# EasyEDA Pro project Amplifier Module C.eprj

# Schematic Schematic1
Create Date: 2024-02-14; Page Name: P1; Project Name: Amplifier Module C; Schematic Name: Schematic1; Update Date: 2024-05-04; Company: EasyEDA.com; Drawn: EasyEDA; Page Size: A4; Part Number: JLCPCB-002; Reviewed: EasyEDA; Version: V0.1
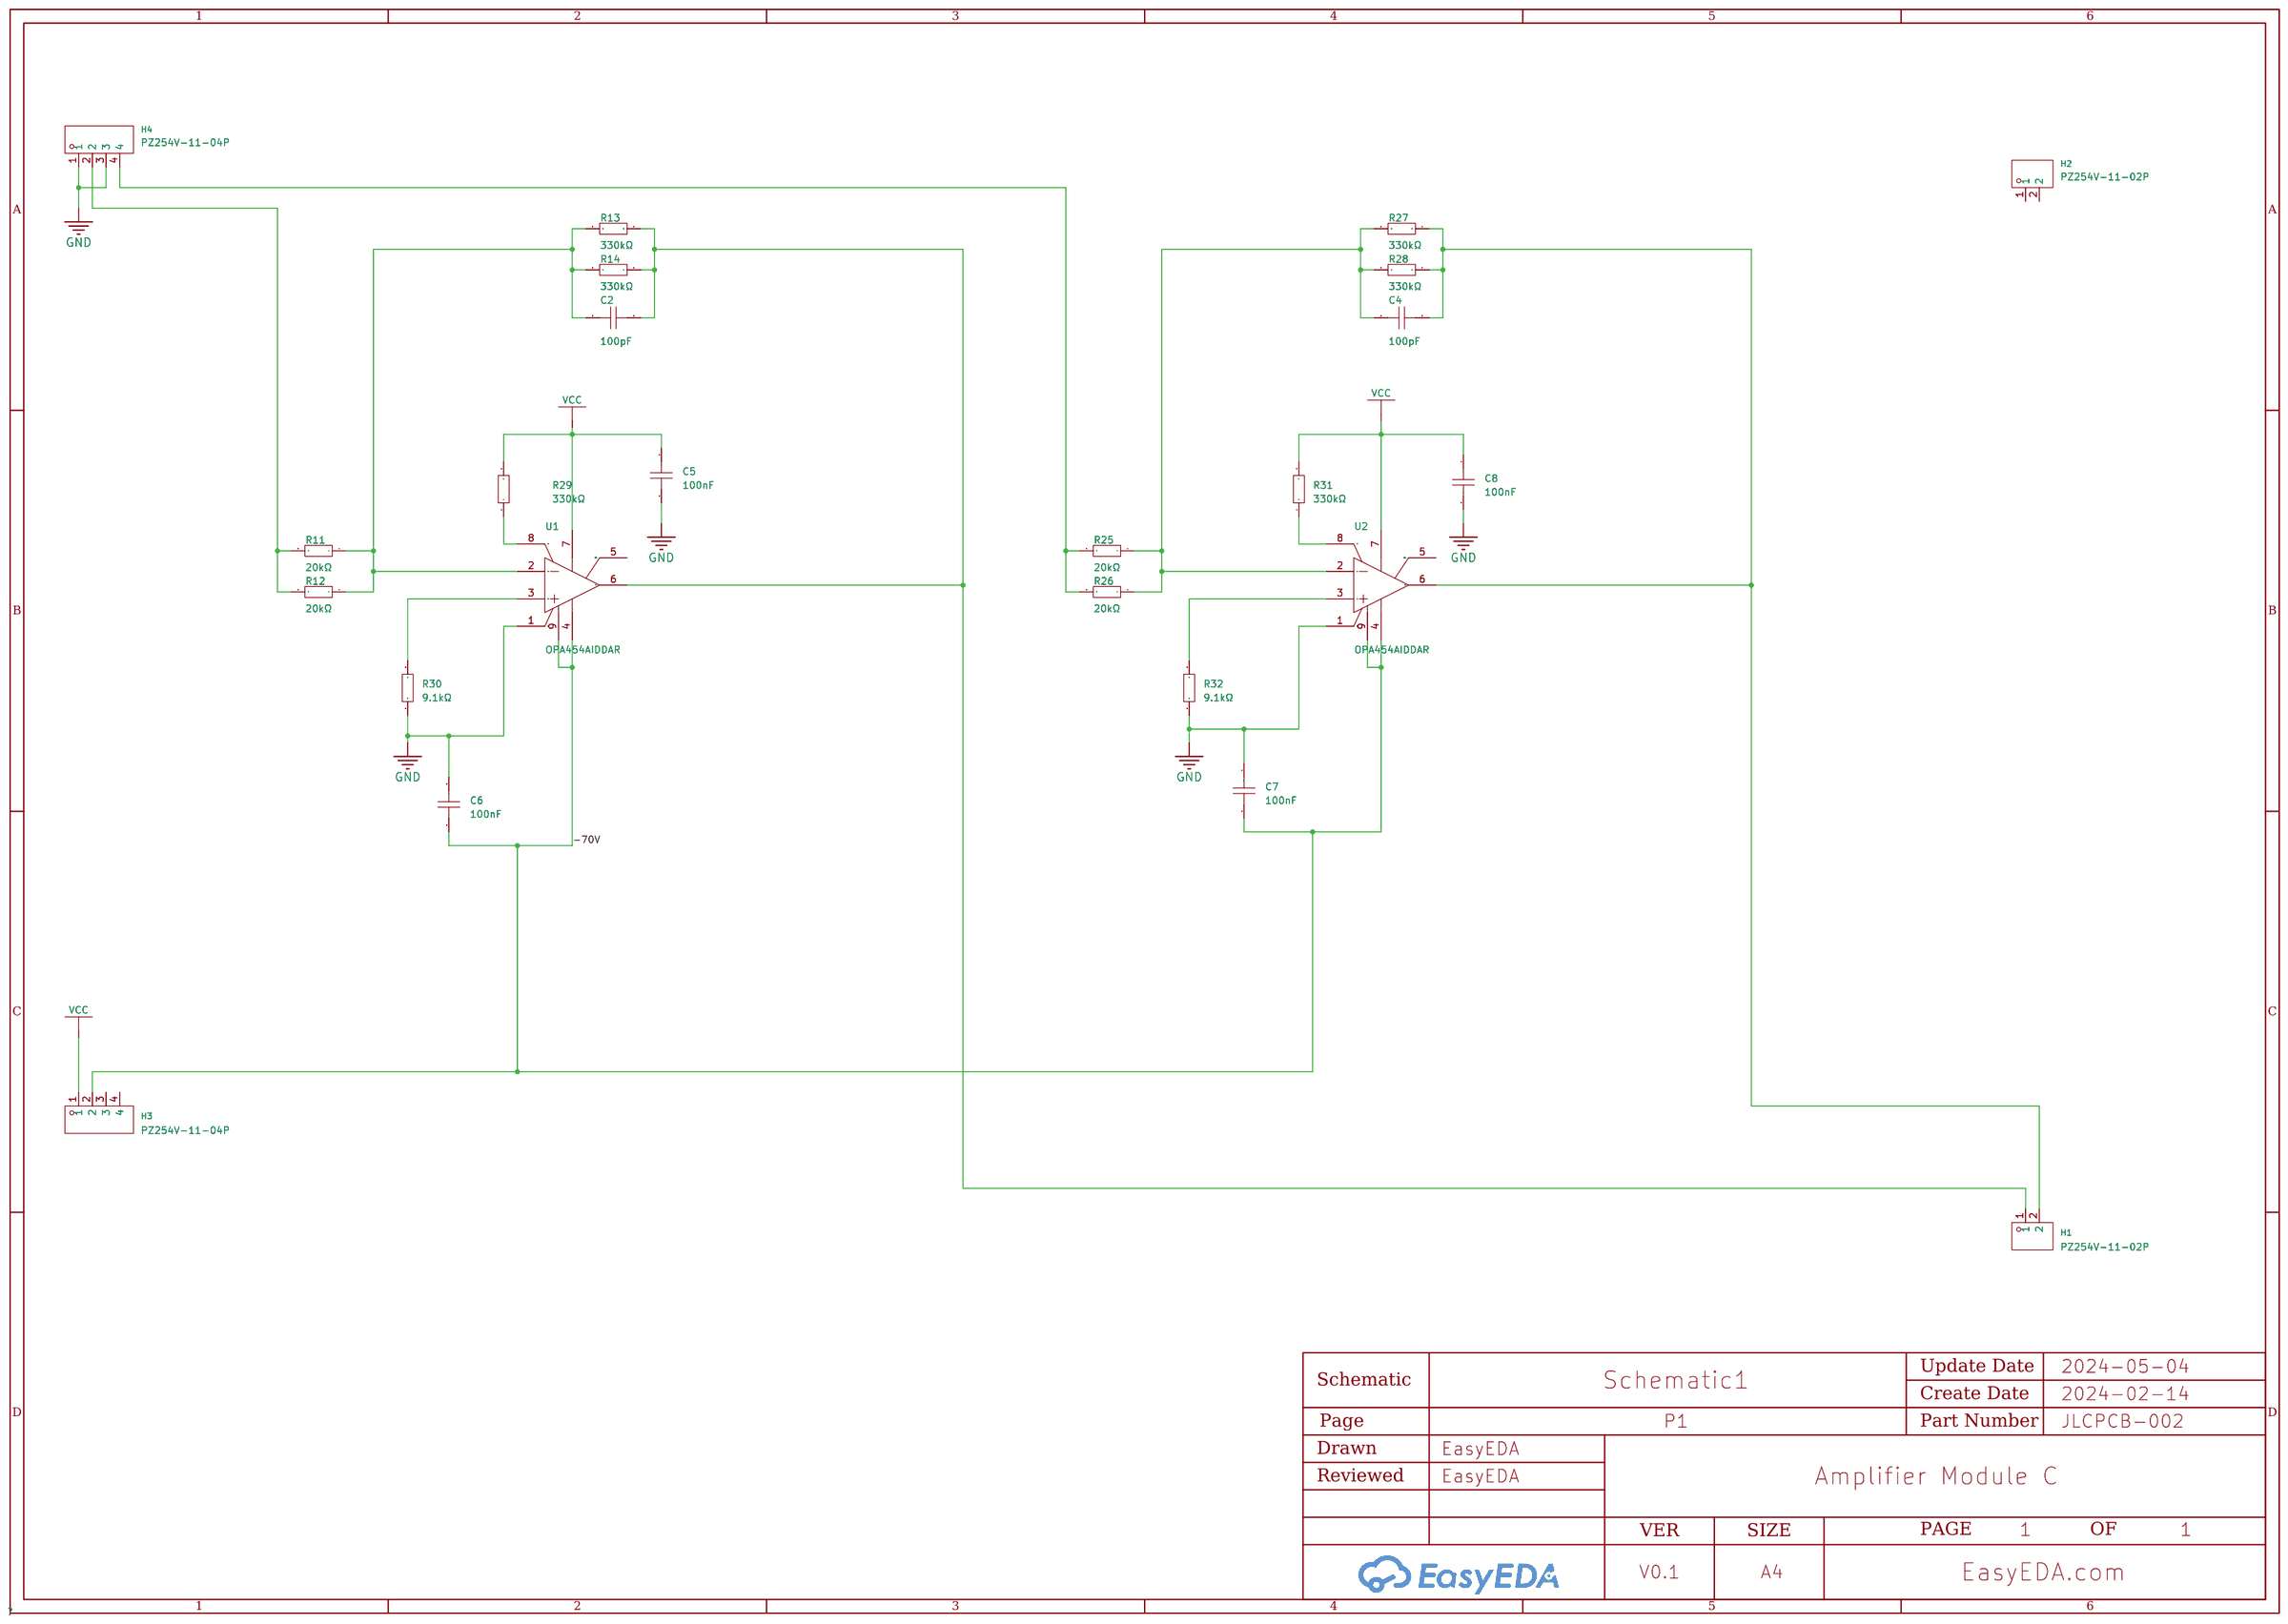
[diagram p0: schematic sheet]

## Parts
C2  100pF  [C0603]
C4  100pF  [C0603]
C5  100nF  [C0603]
C6  100nF  [C0603]
C7  100nF  [C0603]
C8  100nF  [C0603]
H1  PZ254V-11-02P  [HDR-TH_2P-P2.54-V-M]  (no BOM)
H2  PZ254V-11-02P  [HDR-TH_2P-P2.54-V-M]  (no BOM)
H3  PZ254V-11-04P  [HDR-TH_4P-P2.54-V-M]  (no BOM)
H4  PZ254V-11-04P  [HDR-TH_4P-P2.54-V-M]  (no BOM)
R11  20kΩ  [R0603]
R12  20kΩ  [R0603]
R13  330kΩ  [R0603]
R14  330kΩ  [R0603]
R25  20kΩ  [R0603]
R26  20kΩ  [R0603]
R27  330kΩ  [R0603]
R28  330kΩ  [R0603]
R29  330kΩ  [R0603]
R30  9.1kΩ  [R0603]
R31  330kΩ  [R0603]
R32  9.1kΩ  [R0603]
U1  OPA454AIDDAR  [SOIC-8_L4.9-W3.9-P1.27-LS6.0-BL-EP]
U2  OPA454AIDDAR  [SOIC-8_L4.9-W3.9-P1.27-LS6.0-BL-EP]

## Library data of the parts
C2 C4 = 0603CG101J101NT: Capacitance: Tolerance:±5% Tolerance:±5% Voltage Rated: Temperature Coefficient:; LCSC Part Name: 100pF ±5% 100V; Supplier Part: C44567; Manufacturer: FH(风华); Supplier Footprint: 0603; JLCPCB Part Class: Extended Part; Datasheet: https://atta.szlcsc.com/upload/public/pdf/source/20200305/C486355_26A10D38EF8C2A5C37091D0039909270.pdf; Supplier: LCSC; Tolerance: ±5%
C5-C8 = 0603B104K101NT: Capacitance:100nF Tolerance:±10% Tolerance:±10% Voltage Rated: Temperature Coefficient:; LCSC Part Name: 100nF ±10% 100V; Supplier Part: C88219; Manufacturer: FH(风华); Supplier Footprint: 0603; JLCPCB Part Class: Extended Part; Datasheet: https://atta.szlcsc.com/upload/public/pdf/source/20200305/C486355_26A10D38EF8C2A5C37091D0039909270.pdf; Supplier: LCSC; Tolerance: ±10%
H1 H2 = PZ254V-11-02P: Pin Structure:1x2P Pitch:2.54mm Row Spacing:- Circluar Pins/Square Pins:Square Pins Mounting Type:Straight Number of Rows:Plugin Number of Pins:2P Current Rating (Max):- Voltage Rating (Max):- Length of Mating Pin:6mm Insulation Height:2.5mm Length of End; LCSC Part Name: 间距:2.54mm 1x2P 直插 方针; Supplier Part: C492401; Manufacturer: XFCN(兴飞); Supplier Footprint: 插件,P=2.54mm; JLCPCB Part Class: Extended Part; Datasheet: https://atta.szlcsc.com/upload/public/pdf/source/20200309/C492401_A812433581A9B211A7FFA413ADDFF0E5.pdf; Supplier: LCSC; Pin Structure: 1x2P; Pitch: 2.54mm; Circluar Pins/Square Pins: Square Pins; Mounting Type: Straight; Number of Rows: Plugin; Number of Pins: 2P; Length of Mating Pin: 6mm; Insulation Height: 2.5mm; Length of End Connection Pin: 3mm; Operating Temperature Range: -40℃~+105℃; Color: Black
H3 H4 = PZ254V-11-04P: Pin Structure:1x4P Pitch:2.54mm Row Spacing:- Circluar Pins/Square Pins:Square Pins Mounting Type:Straight Number of Rows:Plugin Number of Pins:4P Current Rating (Max):3A Voltage Rating (Max):250V Length of Mating Pin:6mm Insulation Height:2.5mm Length of; LCSC Part Name: 间距:2.54mm 1x4P 直插 方针; Supplier Part: C2691448; Manufacturer: XFCN(兴飞); Supplier Footprint: 插件,P=2.54mm; JLCPCB Part Class: Extended Part; Datasheet: https://atta.szlcsc.com/upload/public/pdf/source/20200309/C492403_F9F19131791D08044AD4F84F8E751A34.pdf; Supplier: LCSC; Pin Structure: 1x4P; Pitch: 2.54mm; Circluar Pins/Square Pins: Square Pins; Mounting Type: Straight; Number of Rows: Plugin; Number of Pins: 4P; Current Rating (Max): 3A; Voltage Rating (Max): 250V; Length of Mating Pin: 6mm; Insulation Height: 2.5mm; Length of End Connection Pin: 3mm; Operating Temperature Range: -40℃~+105℃; Color: Black
R11 R12 R25 R26 = 0603WAF2002T5E: Type:Thick Film Resistors Resistance:20kΩ Tolerance:±1% Tolerance:±1% Power(Watts): Overload Voltage (Max): Temperature Coefficient:±100ppm/℃ Temperature Coefficient:±100ppm/℃ Operating Temperature Range:-55℃~+155℃ Operating Temperature Range:-55℃~+155℃; LCSC Part Name: 20kΩ ±1% 100mW 厚膜电阻; Supplier Part: C4184; Manufacturer: UNI-ROYAL(厚声); Supplier Footprint: 0603; JLCPCB Part Class: Basic Part; Datasheet: https://atta.szlcsc.com/upload/public/pdf/source/20200306/C422600_1E6D84923E4A46A82E41ADD87F860B5C.pdf; Supplier: LCSC; Type: Thick Film Resistors; Tolerance: ±1%; Temperature Coefficient: ±100ppm/℃; Operating Temperature Range: -55℃~+155℃
R13 R14 R27-R29 R31 = 0603WAF3303T5E: Type:Thick Film Resistors Resistance:330kΩ Tolerance:±1% Tolerance:±1% Power(Watts): Overload Voltage (Max): Temperature Coefficient:±100ppm/℃ Temperature Coefficient:±100ppm/℃ Operating Temperature Range:-55℃~+155℃ Operating Temperature Range:-55℃~+155℃; LCSC Part Name: 330kΩ ±1% 100mW 厚膜电阻; Supplier Part: C23137; Manufacturer: UNI-ROYAL(厚声); Supplier Footprint: 0603; JLCPCB Part Class: Basic Part; Datasheet: https://atta.szlcsc.com/upload/public/pdf/source/20200306/C422600_1E6D84923E4A46A82E41ADD87F860B5C.pdf; Supplier: LCSC; Type: Thick Film Resistors; Tolerance: ±1%; Temperature Coefficient: ±100ppm/℃; Operating Temperature Range: -55℃~+155℃
R30 R32 = 0603WAF9101T5E: Type:Thick Film Resistors Resistance:9.1kΩ Tolerance:±1% Tolerance:±1% Power(Watts): Overload Voltage (Max): Temperature Coefficient:±100ppm/℃ Temperature Coefficient:±100ppm/℃ Operating Temperature Range:-55℃~+155℃ Operating Temperature Range:-55℃~+155℃; LCSC Part Name: 9.1kΩ ±1% 100mW 厚膜电阻; Supplier Part: C23260; Manufacturer: UNI-ROYAL(厚声); Supplier Footprint: 0603; JLCPCB Part Class: Basic Part; Datasheet: https://atta.szlcsc.com/upload/public/pdf/source/20200306/C422600_1E6D84923E4A46A82E41ADD87F860B5C.pdf; Supplier: LCSC; Type: Thick Film Resistors; Tolerance: ±1%; Temperature Coefficient: ±100ppm/℃; Operating Temperature Range: -55℃~+155℃
U1 U2 = OPA454AIDDAR: Number of Circuits:单路 Gain Bandwidth Product(GBP):2.5MHz Current - Input Bias(Ib):1.4pA Slew Rate(SR):13V/us Output Current:- -3db Bandwidth:- Supply Current:3.2mA Operating Temperature:-40℃~+85℃ Operating Temperature:-40℃~+85℃; Supplier Part: C50636; Manufacturer: TI(德州仪器); Supplier Footprint: SOIC-8-EP; JLCPCB Part Class: Extended Part; Datasheet: https://www.ti.com/cn/lit/gpn/opa454; Supplier: LCSC; Number of Circuits: 单路; Gain Bandwidth Product(GBP): 2.5MHz; Current - Input Bias(Ib): 1.4pA; Slew Rate(SR): 13V/us; Supply Current: 3.2mA; Operating Temperature: -40℃~+85℃

## Nets
-70V: C6.2 C7.2 H3.2 U1.4(V-) U1.9(EP) U2.4(V-) U2.9(EP)
GND: C5.2 C6.1 C7.1 C8.2 H4.1 H4.3 R30.1 R32.1 U1.1(ED COM) U2.1(ED COM)
VCC: C5.1 C8.1 H3.1 R29.2 R31.2 U1.7(V+) U2.7(V+)
$1N1603: C2.2 R11.1 R12.1 R13.2 R14.2 U1.2(IN-)
$1N4259: H4.2 R11.2 R12.2
$1N6277: C4.2 R25.1 R26.1 R27.2 R28.2 U2.2(IN-)
$1N6394: H4.4 R25.2 R26.2
$1N18596: R29.1 U1.8(ED)
$1N18673: R30.2 U1.3(IN+)
$1N18724: C2.1 H1.1 R13.1 R14.1 U1.6(OUT)
$1N18881: R31.1 U2.8(ED)
$1N18885: R32.2 U2.3(IN+)
$1N18975: C4.1 H1.2 R27.1 R28.1 U2.6(OUT)

Not connected (* = marked no-connect by the designer): H2 1 2; H3 3 4; U1 5(STATUS FLAG); U2 5(STATUS FLAG)

# Board PCB1
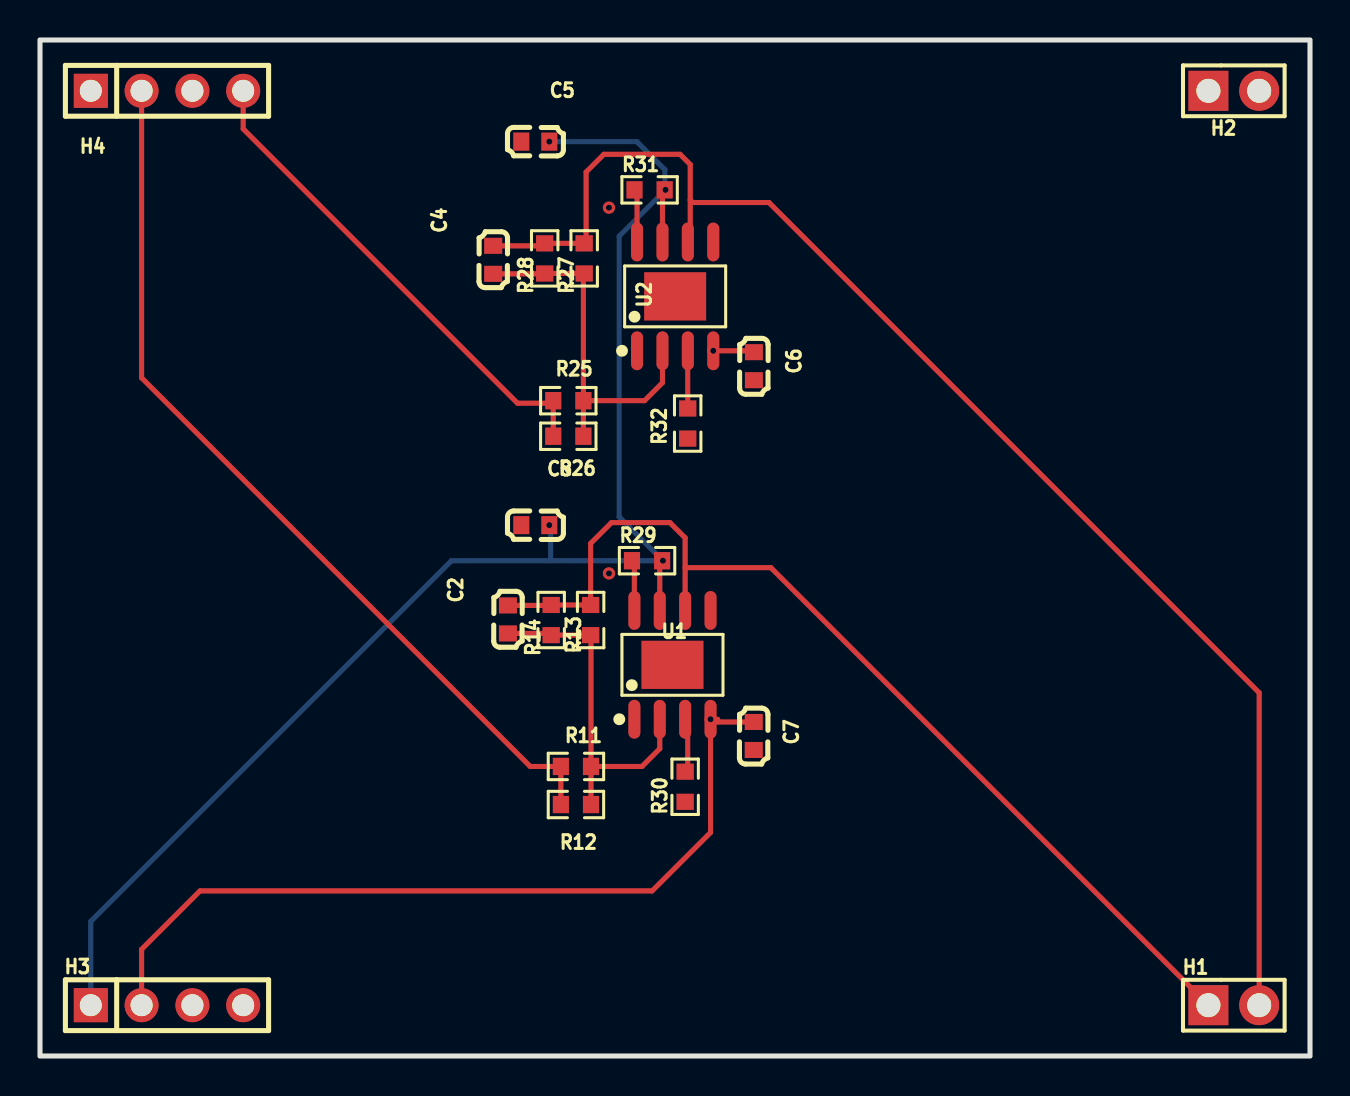
[diagram p1: board, top side]
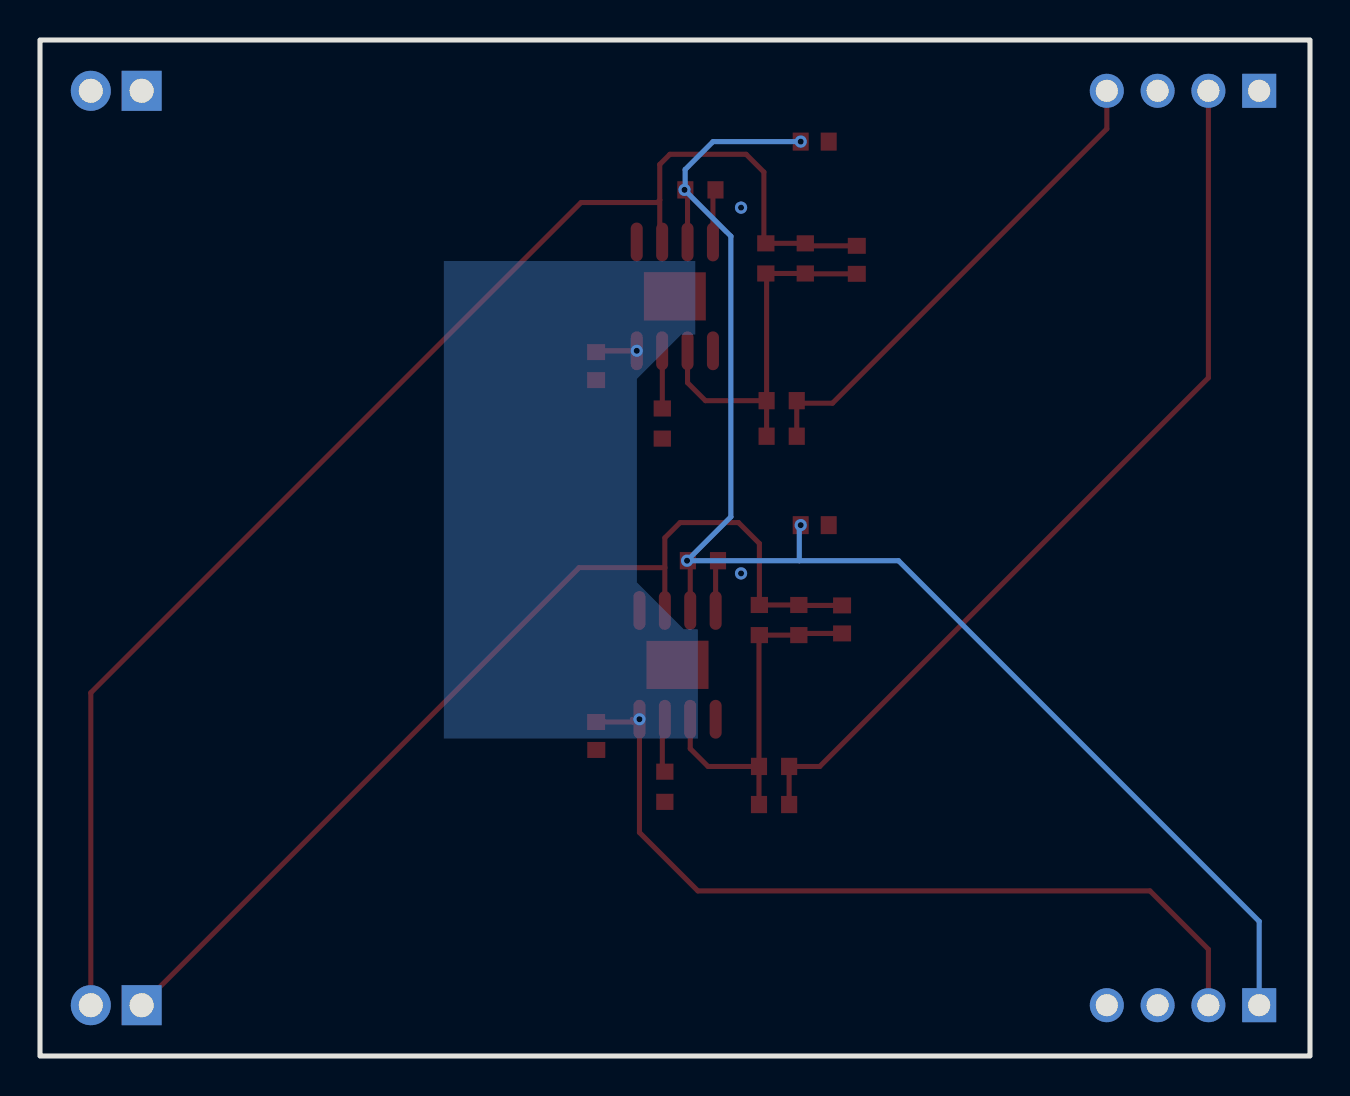
[diagram p2: board, bottom side, seen from below]

Outline 63.5 x 50.8 mm; copper layers: Top Layer, Bottom Layer. Coordinates in mm from the lower left corner of the outline.
Outline path: rectangle 0,50.8 63.5,0
Stack: Top Layer 0.035mm / Dielectric1 1.51mm FR4 er 4.5 / Bottom Layer 0.035mm

## Design rules (mm)
template: JLCPCB Capability(Two Layers Board)
spacing copperThickness1oz (default): track to track 0.102, other pairs 0.152 to 0.3
spacing copperThickness2oz: track to track 0.203, other pairs 0.152 to 0.3
track width copperThickness1oz (default): min 0.127, default 0.254, max 2.54
track width copperThickness2oz: min 0.203, default 0.254, max 2.54
differential pair differentialPair (default): width min 0.127, default 0.254, max 2.54; gap min 0.152, default 0.152
via viaSize (default): diameter min 0.5, default 0.61, max 10; hole min 0.3, default 0.305, max 6.3

## Placement (name value [footprint] x y rotation side)
C2  100pF  [C0603]  23.4 21.83 270 top
C4  100pF  [C0603]  22.66 39.81 270 top
C5  100nF  [C0603]  24.76 45.72 180 top
C6  100nF  [C0603]  35.7 34.49 90 top
C7  100nF  [C0603]  35.69 16 90 top
C8  100nF  [C0603]  24.76 26.54 180 top
H1  PZ254V-11-02P  [HDR-TH_2P-P2.54-V-M]  59.69 2.54 0 top
H2  PZ254V-11-02P  [HDR-TH_2P-P2.54-V-M]  59.69 48.26 0 top
H3  PZ254V-11-04P  [HDR-TH_4P-P2.54-V-M]  6.35 2.54 0 top
H4  PZ254V-11-04P  [HDR-TH_4P-P2.54-V-M]  6.35 48.26 0 top
R11  20kΩ  [R0603]  26.8 14.48 180 top
R12  20kΩ  [R0603]  26.8 12.57 180 top
R13  330kΩ  [R0603]  27.53 21.8 270 top
R14  330kΩ  [R0603]  25.56 21.8 270 top
R25  20kΩ  [R0603]  26.42 32.77 180 top
R26  20kΩ  [R0603]  26.42 30.99 180 top
R27  330kΩ  [R0603]  27.21 39.88 270 top
R28  330kΩ  [R0603]  25.24 39.88 270 top
R29  330kΩ  [R0603]  30.35 24.77 0 top
R30  9.1kΩ  [R0603]  32.26 13.46 90 top
R31  330kΩ  [R0603]  30.48 43.31 0 top
R32  9.1kΩ  [R0603]  32.38 31.62 90 top
U1  OPA454AIDDAR  [SOIC-8_L4.9-W3.9-P1.27-LS6.0-BL-EP]  31.62 19.56 0 top
U2  OPA454AIDDAR  [SOIC-8_L4.9-W3.9-P1.27-LS6.0-BL-EP]  31.76 37.98 0 top

## Footprints (pads in the part's own frame, mm; a bottom-side part is the same pattern mirrored in y, then rotated)
C0603
  rect 0.8x0.9 smd: 1(-0.7,0) 2(0.7,0)
HDR-TH_2P-P2.54-V-M
  rect 2x2 hole 1.2: 1(-1.27,0)
  round 2 hole 1.2: 2(1.27,0)
HDR-TH_4P-P2.54-V-M
  rect 1.7x1.7 hole 1.1: 1(-3.81,0)
  round 1.7 hole 1.1: 2(-1.27,0) 3(1.27,0) 4(3.81,0)
R0603
  rect 0.806x0.864 smd: 1(-0.753,0) 2(0.753,0)
SOIC-8_L4.9-W3.9-P1.27-LS6.0-BL-EP
  oval 0.602x1.941 smd: 1(-1.905,-2.72) 2(-0.635,-2.72) 3(0.635,-2.72) 4(1.905,-2.72) 5(1.905,2.72) 6(0.635,2.72) 7(-0.635,2.72) 8(-1.905,2.72)
  rect 3.098x2.41 smd: 9(0,0)

## Nets
As in the schematic.

Pads without a net: H2 1 2; H3 3 4; U1 5; U2 5

## Via types
v1: diameter 0.61, hole 0.305, Top Layer to Bottom Layer, 8 vias

## Routing (per net, layer and track width the routed paths; a pad name or vN(x,y) marks a point on that pad's centre or on a via; arc(x,y) is an arc through that point)
-70V: length 43.3
  Top Layer w0.254: v1(33.53,16.84) 33.53,11.18 30.61,8.25 8,8.25 5.08,5.33 H3.2 ; 33.88,16.84 33.88,16.7 C7.2 ; v1(33.66,35.26) 35.63,35.26 C6.2
GND:
  vias: v1(28.45,42.42) v1(28.45,24.13)
VCC: length 75.1
  Top Layer w0.254: U1.7 30.99,24.65 R29.2 ; U2.7 31.12,43.2 R31.2
  Bottom Layer w0.254: v1(25.47,26.54) 25.53,26.47 25.53,24.77 ; 25.53,24.77 20.57,24.77 2.54,6.73 H3.1 ; 25.53,24.77 v1(31.15,24.77) 28.96,26.96 28.96,40.99 v1(31.28,43.31) 31.24,43.34 31.24,44.32 29.84,45.72 v1(25.47,45.72)
$1N1603: length 17.9
  Top Layer w0.254: R11.1 R12.1 ; R11.1 30.1,14.48 30.99,15.37 U1.2 ; R11.1 27.55,21.03 R13.2 R14.2 25.47,21.13 C2.2
$1N4259: length 45.3
  Top Layer w0.254: H4.2 5.08,33.91 24.51,14.48 R11.2 R12.2
$1N6277: length 18.6
  Top Layer w0.254: R25.1 30.23,32.77 31.12,33.66 U2.2 ; R25.1 R26.1 ; R25.1 27.17,39.09 R27.2 R28.2 25.22,39.11 C4.2
$1N6394: length 24.9
  Top Layer w0.254: H4.4 10.16,46.36 23.88,32.64 25.54,32.64 R25.2 R26.2
$1N18596: length 2.5
  Top Layer w0.254: R29.1 29.72,24.65 U1.8
$1N18673: length 2.7
  Top Layer w0.254: U1.3 32.38,16.71 32.38,14.34 R30.2
$1N18724: length 51.5
  Top Layer w0.254: C2.1 25.54,22.53 R14.1 R13.1 27.53,25.63 28.57,26.67 31.5,26.67 32.26,25.91 32.26,24.42 ; 32.26,24.42 36.54,24.42 H1.1 ; 32.26,24.42 U1.6
$1N18881: length 2.7
  Top Layer w0.254: U2.8 29.85,43.18 R31.1
$1N18885: length 2.9
  Top Layer w0.254: R32.2 32.38,35.25 U2.3
$1N18975: length 72.2
  Top Layer w0.254: 32.51,42.8 32.51,44.58 32,45.08 28.19,45.08 27.31,44.2 27.31,40.73 R27.1 R28.1 25.11,40.51 C4.1 ; 32.51,42.8 32.51,40.82 U2.6 ; 32.51,42.8 32.64,42.67 36.45,42.67 60.96,18.16 H1.2

## Copper pours and planes (outline as drawn; the poured copper is in the pictures)
-70V on Bottom Layer: 30.61,39.75 43.31,39.75 43.31,15.88 30.61,15.88
GND on Top Layer: 0.25,50.55 63.25,50.55 63.25,0.25 0.25,0.25
GND on Bottom Layer: 0.25,50.55 63.25,50.55 63.25,0.25 0.25,0.25
